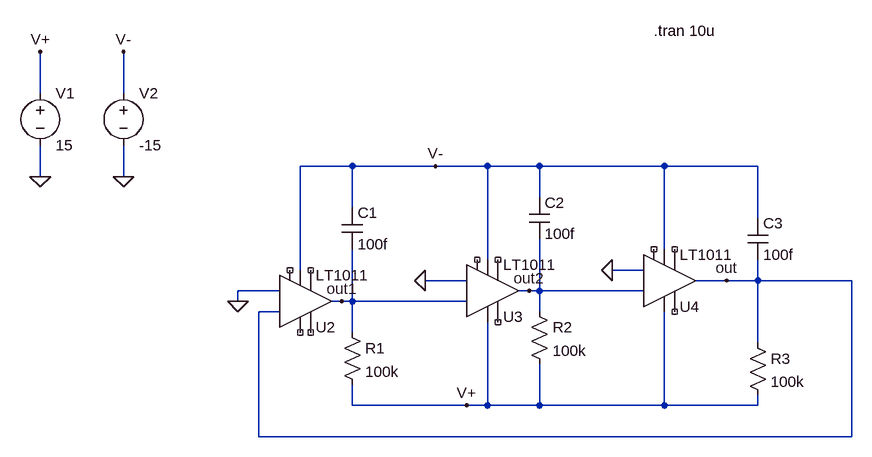
[diagram p0: schematic LT1011_schema.asc]
LT1011_schema.asc, the LTspice schematic file:
Version 4
SHEET 1 880 680
WIRE -512 -112 -512 -176
WIRE -384 -112 -384 -176
WIRE -32 0 -112 0
WIRE 96 0 -32 0
WIRE 176 0 96 0
WIRE 256 0 176 0
WIRE 448 0 256 0
WIRE 592 0 448 0
WIRE -512 16 -512 -32
WIRE -384 16 -384 -32
WIRE 256 48 256 0
WIRE -32 64 -32 0
WIRE 592 80 592 0
WIRE 448 128 448 0
WIRE 176 144 176 0
WIRE -112 160 -112 0
WIRE 416 160 368 160
WIRE 144 176 80 176
WIRE 544 176 496 176
WIRE 592 176 592 144
WIRE 592 176 544 176
WIRE 736 176 592 176
WIRE -144 192 -208 192
WIRE 240 192 224 192
WIRE 256 192 256 112
WIRE 256 192 240 192
WIRE 416 192 256 192
WIRE -208 208 -208 192
WIRE -48 208 -64 208
WIRE -32 208 -32 128
WIRE -32 208 -48 208
WIRE 144 208 -32 208
WIRE -144 224 -176 224
WIRE 256 224 256 192
WIRE -32 256 -32 208
WIRE 592 272 592 176
WIRE -32 368 -32 336
WIRE 144 368 -32 368
WIRE 176 368 176 240
WIRE 176 368 144 368
WIRE 256 368 256 304
WIRE 256 368 176 368
WIRE 448 368 448 224
WIRE 448 368 256 368
WIRE 592 368 592 352
WIRE 592 368 448 368
WIRE -176 416 -176 224
WIRE 736 416 736 176
WIRE 736 416 -176 416
FLAG -208 208 0
FLAG 96 0 V-
FLAG 144 368 V+
FLAG 80 176 0
FLAG 368 160 0
FLAG -512 16 0
FLAG -384 16 0
FLAG -512 -176 V+
FLAG -384 -176 V-
FLAG 544 176 out
FLAG 240 192 out2
FLAG -48 208 out1
SYMBOL voltage -512 -128 R0
WINDOW 123 0 0 Left 2
WINDOW 39 0 0 Left 2
SYMATTR InstName V1
SYMATTR Value 15
SYMBOL voltage -384 -128 R0
WINDOW 123 0 0 Left 2
WINDOW 39 0 0 Left 2
SYMATTR InstName V2
SYMATTR Value -15
SYMBOL Comparators\\LT1011 -112 208 M180
SYMATTR InstName U2
SYMBOL Comparators\\LT1011 176 192 M180
SYMATTR InstName U3
SYMBOL Comparators\\LT1011 448 176 M180
SYMATTR InstName U4
SYMBOL cap -48 64 R0
SYMATTR InstName C1
SYMATTR Value 100f
SYMBOL cap 240 48 R0
SYMATTR InstName C2
SYMATTR Value 100f
SYMBOL cap 576 80 R0
SYMATTR InstName C3
SYMATTR Value 100f
SYMBOL res -48 240 R0
SYMATTR InstName R1
SYMATTR Value 100k
SYMBOL res 240 208 R0
SYMATTR InstName R2
SYMATTR Value 100k
SYMBOL res 576 256 R0
SYMATTR InstName R3
SYMATTR Value 100k
TEXT 432 -208 Left 2 !.tran 10u

The netlist it stands for:
* LT1011_schema.asc
V1 V+ 0 15
V2 V- 0 -15
XU2 NC_01 0 out V- NC_02 NC_03 out1 NC_04 LT1011
XU3 NC_05 0 out1 V- NC_06 NC_07 out2 V+ LT1011
XU4 NC_08 0 out2 V- NC_09 NC_10 out V+ LT1011
C1 V- out1 100f
C2 V- out2 100f
C3 V- out 100f
R1 out1 V+ 100k
R2 out2 V+ 100k
R3 out V+ 100k
.tran 10u
.lib LTC1.lib
.backanno
.end